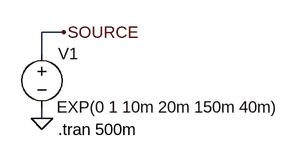
[diagram p0: schematic Fig_2-37_V-source-EXP.asc]
Fig_2-37_V-source-EXP.asc, the LTspice schematic file:
Version 4
SHEET 1 880 680
WIRE 144 80 112 80
WIRE 112 112 112 80
WIRE 112 208 112 192
FLAG 112 208 0
FLAG 144 80 SOURCE
SYMBOL voltage 112 96 R0
WINDOW 3 22 95 Left 2
WINDOW 123 0 0 Left 2
WINDOW 39 0 0 Left 2
SYMATTR Value EXP(0 1 10m 20m 150m 40m)
SYMATTR InstName V1
TEXT 136 224 Left 2 !.tran 500m

The netlist it stands for:
* Fig_2-37_V-source-EXP.asc
V1 SOURCE 0 EXP(0 1 10m 20m 150m 40m)
.tran 500m
.backanno
.end